# Altium project project_vodorezov_switch.PrjPcb
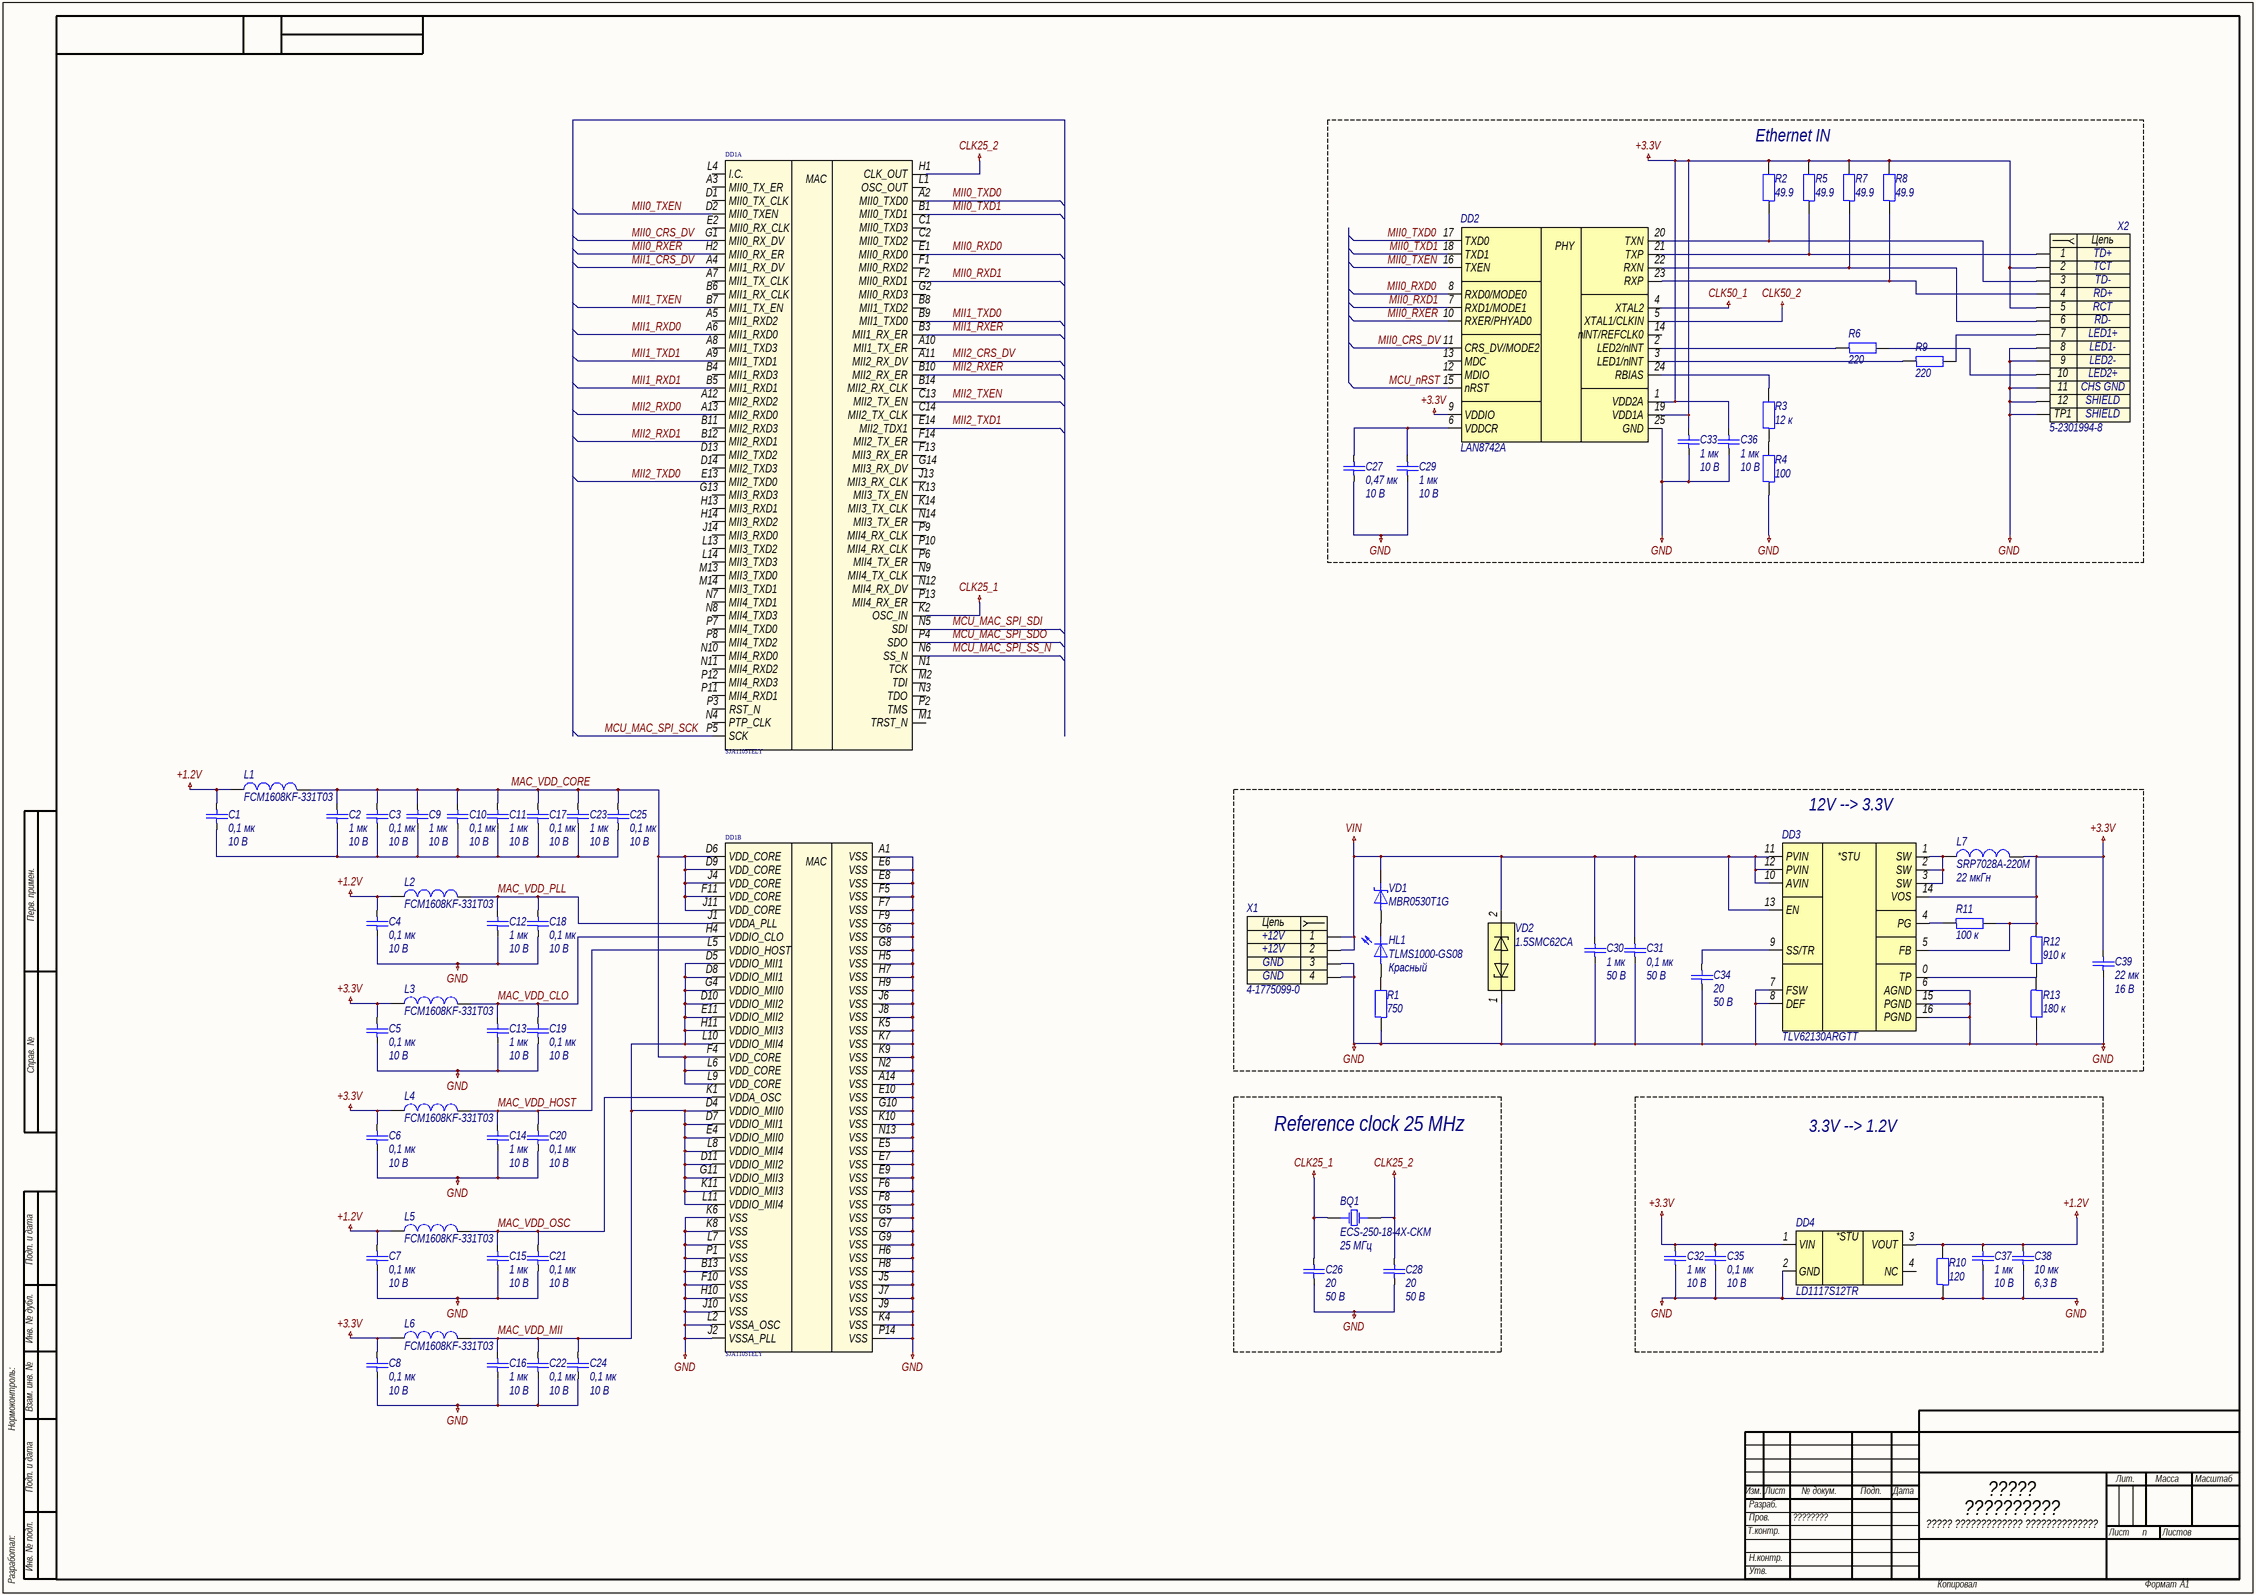
[diagram p0: project_vodorezov_switch1.SchDoc]
approver: ????????; check: ????????; designation: ?????.3331506.02; developer: ?????????; document_code: ?3; document_type: ????? ????????????? ??????????????; pcb_dec_number: ?????.3331506.02; project: project_vodorezpv_switch; sheets_total: M; title: ????? ??????????; title_line_1: ?????; title_line_2: ??????????
3 sheets, 130 parts. Net scope: global (net labels, ports and power ports of the same name join across sheets).
Board file: project_vodorezov_switch.PcbDoc
Sheets:
  project_vodorezov_switch1.SchDoc
  project_vodorezov_switch2.SchDoc
  project_vodorezov_switch3.SchDoc

## Sheet project_vodorezov_switch1.SchDoc: ????? ??????????
size 840 x 594 mm; ApprovedBy: ????????; CheckedBy: ????????; DrawnBy: ?????????; DocumentNumber: ?????.3331506.02?3; SheetNumber: n; SheetTotal: M; DocumentCode: ?3; ImagePath: ?????.3331506.02

### Parts
BQ1  ECS-250-18-4X-СKM  Частотa: 25 МГц  [HC-49/US]
C1  0,1 мк  Напряжение: 10 В  [C0603]
C2  1 мк  Напряжение: 10 В  [C0603]
C3  0,1 мк  Напряжение: 10 В  [C0603]
C4  0,1 мк  Напряжение: 10 В  [C0603]
C5  0,1 мк  Напряжение: 10 В  [C0603]
C6  0,1 мк  Напряжение: 10 В  [C0603]
C7  0,1 мк  Напряжение: 10 В  [C0603]
C8  0,1 мк  Напряжение: 10 В  [C0603]
C9  1 мк  Напряжение: 10 В  [C0603]
C10  0,1 мк  Напряжение: 10 В  [C0603]
C11  1 мк  Напряжение: 10 В  [C0603]
C12  1 мк  Напряжение: 10 В  [C0603]
C13  1 мк  Напряжение: 10 В  [C0603]
C14  1 мк  Напряжение: 10 В  [C0603]
C15  1 мк  Напряжение: 10 В  [C0603]
C16  1 мк  Напряжение: 10 В  [C0603]
C17  0,1 мк  Напряжение: 10 В  [C0603]
C18  0,1 мк  Напряжение: 10 В  [C0603]
C19  0,1 мк  Напряжение: 10 В  [C0603]
C20  0,1 мк  Напряжение: 10 В  [C0603]
C21  0,1 мк  Напряжение: 10 В  [C0603]
C22  0,1 мк  Напряжение: 10 В  [C0603]
C23  1 мк  Напряжение: 10 В  [C0603]
C24  0,1 мк  Напряжение: 10 В  [C0603]
C25  0,1 мк  Напряжение: 10 В  [C0603]
C26  20  Напряжение: 50 В  [C0402]
C27  0,47 мк  Напряжение: 10 В  [C0603]
C28  20  Напряжение: 50 В  [C0402]
C29  1 мк  Напряжение: 10 В  [C0603]
C30  1 мк  Напряжение: 50 В  [C0603]
C31  0,1 мк  Напряжение: 50 В  [C0603]
C32  1 мк  Напряжение: 10 В  [C0603]
C33  1 мк  Напряжение: 10 В  [C0603]
C34  20  Напряжение: 50 В  [C0603]
C35  0,1 мк  Напряжение: 10 В  [C0603]
C36  1 мк  Напряжение: 10 В  [C0603]
C37  1 мк  Напряжение: 10 В  [C0603]
C38  10 мк  Напряжение: 6,3 В  [C0603]
C39  22 мк  Напряжение: 16 В  [C1206]
DD1  SJA1105TELY  [BGA159]  (parts A,B of 2)
DD2  LAN8742A  [QFN-24-P50-400X400X80-L40X25-T270X270]
DD3  TLV62130ARGTT  [WQFN-16-P50-300X300X100-L40X24-T168X168]
DD4  LD1117S12TR  [SOT230P700X180-4N]
HL1  TLMS1000-GS08  Цвет: Красный  [HL0603]
L1  FCM1608KF-331T03  [FCM-2-0603]
L2  FCM1608KF-331T03  [FCM-2-0603]
L3  FCM1608KF-331T03  [FCM-2-0603]
L4  FCM1608KF-331T03  [FCM-2-0603]
L5  FCM1608KF-331T03  [FCM-2-0603]
L6  FCM1608KF-331T03  [FCM-2-0603]
L7  SRP7028A-220M  Индуктивность: 22 мкГн  [SRP-2-730X660X280]
R1  750  [R0603]
R2  49.9  [R0603]
R3  12 к  [R0603]
R4  100  [R0603]
R5  49.9  [R0603]
R6  220  [R0603]
R7  49.9  [R0603]
R8  49.9  [R0603]
R9  220  [R0603]
R10  120  [R0603]
R11  100 к  [R0603]
R12  910 к  [R0603]
R13  180 к  [R0603]
VD1  MBR0530T1G  [SOD-123-368X160X135]
VD2  1.5SMC62CA  [DO-214AB-790X590X262]
X1  4-1775099-0  [4-1775099-0]
X2  5-2301994-8  [5-2301994-8]

### Blocks framed on the sheet
Ethernet IN: C27 C29 C33 C36 DD2 R2-R9 X2
12V --> 3.3V: C30 C31 C34 C39 DD3 HL1 L7 R1 R11-R13 VD1 VD2 X1
Reference clock 25 MHz: BQ1 C26 C28
3.3V --> 1.2V: C32 C35 C37 C38 DD4 R10

### Nets
+1.2V: C1.1 C4.1 C7.1 C37.1 C38.1 DD4.3(VOUT) L1.1 L2.1 L5.1 R10.2
+3.3V: C5.1 C6.1 C8.1 C32.1 C33.1 C35.1 C36.1 C39.1 DD2.1(VDD2A) DD2.5(XTAL1/CLKIN) DD2.9(VDDIO) DD2.19(VDD1A) DD3.5(FB) DD3.14(VOS) DD4.1(VIN) L3.1 L4.1 L6.1 L7.2 R2.2 R5.2 R7.2 R8.2 R11.2 R12.1 X2.2 X2.5  [also labelled CLK50_2]
CLK25_1: C26.1 DD1.K2(OSC_IN)
CLK25_2: BQ1.2 C28.1 DD1.H1(CLK_OUT)
CLK50_1: DD2.4(XTAL2)
GND: C4.2 C5.2 C6.2 C7.2 C8.2 C12.2 C13.2 C14.2 C15.2 C16.2 C18.2 C19.2 C20.2 C21.2 C22.2 C24.2 C26.2 C27.2 C28.2 C29.2 C30.2 C31.2 C32.2 C33.2 C34.2 C35.2 C36.2 C37.2 C38.2 C39.2 DD1.A1(VSS) DD1.A14(VSS) DD1.B13(VSS) DD1.E5(VSS) DD1.E6(VSS) DD1.E7(VSS) DD1.E8(VSS) DD1.E9(VSS) DD1.E10(VSS) DD1.F5(VSS) DD1.F6(VSS) DD1.F7(VSS) DD1.F8(VSS) DD1.F9(VSS) DD1.F10(VSS) DD1.G5(VSS) DD1.G6(VSS) DD1.G7(VSS) DD1.G8(VSS) DD1.G9(VSS) DD1.G10(VSS) DD1.H5(VSS) DD1.H6(VSS) DD1.H7(VSS) DD1.H8(VSS) DD1.H9(VSS) DD1.H10(VSS) DD1.J2(VSSA_PLL) DD1.J5(VSS) DD1.J6(VSS) DD1.J7(VSS) DD1.J8(VSS) DD1.J9(VSS) DD1.J10(VSS) DD1.K4(VSS) DD1.K5(VSS) DD1.K6(VSS) DD1.K7(VSS) DD1.K8(VSS) DD1.K9(VSS) DD1.K10(VSS) DD1.L2(VSSA_OSC) DD1.L7(VSS) DD1.N2(VSS) DD1.N13(VSS) DD1.P1(VSS) DD1.P14(VSS) DD2.25(GND) DD3.6(AGND) DD3.7(FSW) DD3.8(DEF) DD3.15(PGND) DD3.16(PGND) DD4.2(GND) R1.1 R4.1 R10.1 R13.2 VD2.1 X1.3 X1.4 X2.8 X2.9 X2.11 X2.12 X2.TP1
VIN: C30.1 C31.1 DD3.10(AVIN) DD3.11(PVIN) DD3.12(PVIN) DD3.13(EN) VD1.1 VD2.2 X1.1 X1.2
MAC_VDD_CLO: C13.1 C19.1 DD1.H4(VDDIO_CLO) L3.2
MAC_VDD_CORE: C2.1 C3.1 C9.1 C10.1 C11.1 C17.1 C23.1 C25.1 DD1.D6(VDD_CORE) DD1.D9(VDD_CORE) DD1.F4(VDD_CORE) DD1.F11(VDD_CORE) DD1.J4(VDD_CORE) DD1.J11(VDD_CORE) DD1.L6(VDD_CORE) DD1.L9(VDD_CORE) L1.2
MAC_VDD_HOST: C14.1 C20.1 DD1.L5(VDDIO_HOST) L4.2
MAC_VDD_MII: C16.1 C22.1 C24.1 DD1.D4(VDDIO_MII0) DD1.D5(VDDIO_MII1) DD1.D7(VDDIO_MII1) DD1.D8(VDDIO_MII1) DD1.D10(VDDIO_MII2) DD1.D11(VDDIO_MII2) DD1.E4(VDDIO_MII0) DD1.E11(VDDIO_MII2) DD1.G4(VDDIO_MII0) DD1.G11(VDDIO_MII3) DD1.H11(VDDIO_MII3) DD1.K11(VDDIO_MII3) DD1.L8(VDDIO_MII4) DD1.L10(VDDIO_MII4) DD1.L11(VDDIO_MII4) L6.2
MAC_VDD_OSC: C15.1 C21.1 DD1.K1(VDDA_OSC) L5.2
MAC_VDD_PLL: C12.1 C18.1 DD1.J1(VDDA_PLL) L2.2
MCU_MAC_SPI_SCK: DD1.P5(SCK)
MCU_MAC_SPI_SDI: DD1.N5(SDI)
MCU_MAC_SPI_SDO: DD1.P4(SDO)
MCU_MAC_SPI_SS_N: DD1.N6(SS_N)
MCU_nRST: DD2.15(nRST)
MII0_CRS_DV: DD1.G1(MII0_RX_DV) DD2.11(CRS_DV/MODE2)
MII0_RXD0: DD1.E1(MII0_RXD0) DD2.8(RXD0/MODE0)
MII0_RXD1: DD1.F2(MII0_RXD1) DD2.7(RXD1/MODE1)
MII0_RXER: DD1.H2(MII0_RX_ER) DD2.10(RXER/PHYAD0)
MII0_TXD0: DD1.A2(MII0_TXD0) DD2.17(TXD0)
MII0_TXD1: DD1.B1(MII0_TXD1) DD2.18(TXD1)
MII0_TXEN: DD1.D2(MII0_TXEN) DD2.16(TXEN)
MII1_CRS_DV: DD1.A4(MII1_RX_DV)
MII1_RXD0: DD1.A6(MII1_RXD0)
MII1_RXD1: DD1.B5(MII1_RXD1)
MII1_RXER: DD1.B3(MII1_RX_ER)
MII1_TXD0: DD1.B9(MII1_TXD0)
MII1_TXD1: DD1.A9(MII1_TXD1)
MII1_TXEN: DD1.B7(MII1_TX_EN)
MII2_CRS_DV: DD1.A11(MII2_RX_DV)
MII2_RXD0: DD1.A13(MII2_RXD0)
MII2_RXD1: DD1.B12(MII2_RXD1)
MII2_RXER: DD1.B10(MII2_RX_ER)
MII2_TXD0: DD1.E13(MII2_TXD0)
MII2_TXD1: DD1.E14(MII2_TDX1)
MII2_TXEN: DD1.C13(MII2_TX_EN)
NetC1_2: C1.2 C2.2 C3.2 C9.2 C10.2 C11.2 C17.2 C23.2 C25.2
NetC27_1: C27.1 C29.1 DD2.6(VDDCR)
NetC34_1: C34.1 DD3.9(SS/TR)
NetDD2_2: DD2.2(LED2/nlNT) R6.1
NetDD2_3: DD2.3(LED1/nlNT) R9.1
NetDD2_20: DD2.20(TXN) R2.1 X2.3
NetDD2_21: DD2.21(TXP) R5.1 X2.1
NetDD2_22: DD2.22(RXN) R7.1 X2.6
NetDD2_23: DD2.23(RXP) R8.1 X2.4
NetDD2_24: DD2.24(RBIAS) R3.2
NetDD3_0: DD3.0(TP) R12.2 R13.1
NetDD3_1: DD3.1(SW) DD3.2(SW) DD3.3(SW) L7.1
NetDD3_4: DD3.4(PG) R11.1
NetHL1_1: HL1.1 VD1.2
NetHL1_2: HL1.2 R1.2
NetR3_1: R3.1 R4.2
NetR6_2: R6.2 X2.10
NetR9_2: R9.2 X2.7

Not connected (* = marked no-connect by the designer): BQ1 1; DD1 A3(MII0_TX_ER) A5(MII1_RXD2) A7(MII1_TX_CLK) A8(MII1_TXD3) A10(MII1_TX_ER) A12(MII2_RXD2) B4(MII1_RXD3) B6(MII1_RX_CLK) B8(MII1_TXD2) B11(MII2_RXD3) B14(MII2_RX_CLK) C1(MII0_TXD3) C2(MII0_TXD2) C14(MII2_TX_CLK) D1(MII0_TX_CLK) D13(MII2_TXD2) D14(MII2_TXD3) E2(MII0_RX_CLK) F1(MII0_RXD2) F13(MII3_RX_ER) F14(MII2_TX_ER) G2(MII0_RXD3) G13(MII3_RXD3) G14(MII3_RX_DV) H13(MII3_RXD1) H14(MII3_RXD2) J13(MII3_RX_CLK) J14(MII3_RXD0) K13(MII3_TX_EN) K14(MII3_TX_CLK) L1(OSC_OUT) L4(I.C.) L13(MII3_TXD2) L14(MII3_TXD3) M1(TRST_N) M2(TDI) M13(MII3_TXD0) M14(MII3_TXD1) N1(TCK) N3(TDO) N4(PTP_CLK) N7(MII4_TXD1) N8(MII4_TXD3) N9(MII4_TX_CLK) N10(MII4_RXD0) N11(MII4_RXD2) N12(MII4_RX_DV) N14(MII3_TX_ER) P2(TMS) P3(RST_N) P6(MII4_TX_ER) P7(MII4_TXD0) P8(MII4_TXD2) P9(MII4_RX_CLK) P10(MII4_RX_CLK) P11(MII4_RXD1) P12(MII4_RXD3) P13(MII4_RX_ER); DD2 12(MDIO) 13(MDC) 14(nlNT/REFCLK0); DD4 4(NC)

### Notes on the sheet
- Перв. примен.
- Справ. №
- Подп. и дата
- Инв. № дубл.
- Нормоконтроль:
- Взам. инв. №
- Изм.
- Лист
- № докум.
- Подп.
- Дата
- Лит.
- Масса
- Масштаб
- Т.контр.
- Пров.
- Разраб.
- Листов
- Разработал:
- Инв. № подл.
- Н.контр.
- Утв.
- Копировал
- Формат
- А1
- (in symbol dd0017) *STU
- (in symbol dd0025) *STU
- (in symbol dd0028) PHY
- (in symbol dd0029, part A) MAC
- (in symbol dd0029, part B) MAC
- (in symbol x0006) Цепь
- (in symbol x0015) Цепь

### Library data of the parts
BQ1 = bq0008: =Описание; ID: bq0008; Фамилия: Водорезов; Описание: Кварцевый резонатор 25 МГц нагрузочные конденсаторы 18 пФ; Производитель: ECS, Inc. International; Наименование: ECS-250-18-4X-СKM; Частота: 25 МГц; Корпус: HC-49/US; HelpURL: https://ecsxtal.com/hc-49usx
C1 C3-C8 C10 C17-C22 C24 C25 C35 = c0081: =Описание; ID: c0081; Фамилия: Паньков; Описание: Конденсатор керамический чип 0603 100 нФ 10 В ±10 %; Наименование: CC0603KRX7R6BB104; Производитель: YAGEO Corp.; Отклонение: ±10 %; Рабочие температуры: от –55 °С до +125 °С; Температурный коэффициент емкости: X7R; Корпус: 0603; Номинал: 0,1 мк; Номинальное напряжение: 10 В; HelpURL: https://www.yageo.com/upload/media/product/productsearch/datasheet/mlcc/UPY-GPHC_X7R_6.3V-to-50V_20.pdf
C2 C9 C11-C16 C23 C29 C32 C33 C36 C37 = c0112: =Описание; ID: c0112; Фамилия: Паньков; Описание: Конденсатор керамический чип 0603 1 мкФ 10 В ±10 %; Наименование: CC0603KRX5R6BB105; Производитель: YAGEO Corp.; Отклонение: ±10 %; Рабочие температуры: от –55 °С до +85 °С; Температурный коэффициент емкости: X5R; Корпус: 0603; Номинал: 1 мк; Номинальное напряжение: 10 В; HelpURL: https://www.yageo.com/upload/media/product/productsearch/datasheet/mlcc/UPY-GPHC_X5R_4V-to-50V_26.pdf
C26 C28 = c0020: =Описание; ID: c0020; Фамилия: Ляпцев; Описание: Конденсатор керамический чип 0402 20 пФ 50 В ±5 %; Наименование: CC0402JRNPO9BN200; Производитель: YAGEO Corp.; Отклонение: ±5 %; Рабочие температуры: от –55 °С до +125 °С; Температурный коэффициент емкости: C0G; Корпус: 0402; Номинал: 20; Номинальное напряжение: 50 В; HelpURL: https://www.yageo.com/upload/media/product/productsearch/datasheet/mlcc/UPY-GP_NP0_16V-to-50V_18.pdf
C27 = c0103: =Описание; ID: c0103; Фамилия: Паньков; Описание: Конденсатор керамический чип 0603 470 нФ 10 В ±10 %; Наименование: CC0603KRX7R6BB474; Производитель: YAGEO Corp.; Отклонение: ±10 %; Рабочие температуры: от –55 °С до +125 °С; Температурный коэффициент емкости: X7R; Корпус: 0603; Номинал: 0,47 мк; Номинальное напряжение: 10 В; HelpURL: https://www.yageo.com/upload/media/product/productsearch/datasheet/mlcc/UPY-GPHC_X7R_6.3V-to-50V_20.pdf
C30 = c0118: =Описание; ID: c0118; Фамилия: Самарин; Описание: Конденсатор керамический чип 0603 1 мкФ 50 В ±10 %; Наименование: CC0603KPX5R9BB105; Производитель: YAGEO Corp.; Отклонение: ±10 %; Рабочие температуры: от –55 °С до +85 °С; Температурный коэффициент емкости: X5R; Корпус: 0603; Номинал: 1 мк; Номинальное напряжение: 50 В; HelpURL: https://www.yageo.com/upload/media/product/productsearch/datasheet/mlcc/UPY-GPHC_X5R_4V-to-50V_26.pdf
C31 = c0088: =Описание; ID: c0088; Фамилия: Паньков; Описание: Конденсатор керамический чип 0603 100 нФ 50 В ±10 %; Наименование: CC0603KRX7R9BB104; Производитель: YAGEO Corp.; Отклонение: ±10 %; Рабочие температуры: от –55 °С до +125 °С; Температурный коэффициент емкости: X7R; Корпус: 0603; Номинал: 0,1 мк; Номинальное напряжение: 50 В; HelpURL: https://www.yageo.com/upload/media/product/productsearch/datasheet/mlcc/UPY-GPHC_X7R_6.3V-to-50V_20.pdf
C34 = c0021: =Описание; ID: c0021; Фамилия: Паньков; Описание: Конденсатор керамический чип 0603 20 пФ 50 В ±1 %; Наименование: CC0603FRNPO9BN200; Производитель: YAGEO Corp.; Отклонение: ±1 %; Рабочие температуры: от –55 °С до +125 °С; Температурный коэффициент емкости: C0G; Корпус: 0603; Номинал: 20; Номинальное напряжение: 50 В; HelpURL: https://www.yageo.com/upload/media/product/productsearch/datasheet/mlcc/UPY-GP_NP0_16V-to-50V_18.pdf
C38 = c0143: =Описание; ID: c0143; Фамилия: Ляпцев; Описание: Конденсатор керамический чип 0603 10 мкФ 6,3 В ±20 %; Наименование: CC0603MRX5R5BB106; Производитель: YAGEO Corp.; Отклонение: ±20 %; Рабочие температуры: от –55 °С до +85 °С; Температурный коэффициент емкости: X5R; Корпус: 0603; Номинал: 10 мк; Номинальное напряжение: 6,3 В; HelpURL: https://www.yageo.com/upload/media/product/productsearch/datasheet/mlcc/UPY-GPHC_X5R_4V-to-50V_26.pdf
C39 = c0163: =Описание; ID: c0163; Фамилия: Ларионов; Описание: Конденсатор керамический чип 1206 22 мкФ 16 В ±20 %; Наименование: CC1206MKX7R7BB226; Производитель: YAGEO Corp.; Отклонение: ±20 %; Рабочие температуры: от –55 °С до +125 °С; Температурный коэффициент емкости: X7R; Корпус: 1206; Номинал: 22 мк; Номинальное напряжение: 16 В; HelpURL: https://www.yageo.com/upload/media/product/productsearch/datasheet/mlcc/UPY-GPHC_X7R_6.3V-to-50V_20.pdf
DD1 = dd0029: =Описание; SourceLibrary: Add_to_database_2020-10-19; Vendor: NXP; Built_By: EMA_Matt; ID: dd0029; Фамилия: Водорезов; Описание: Ethernet-switch на 5 выхода; Корпус: LFBGA-159; Datasheet: https://www.nxp.com/docs/en/data-sheet/SJA1105.pdf; Manufacturer_Part_Number: SJA1105TELY; Copyright: Copyright (C) 2018 Accelerated Designs. All rights reserved; RefDes: RefDes; Type: DEV; Наименование: SJA1105; Производитель: NXP; HelpURL: https://www.nxp.com/docs/en/data-sheet/SJA1105.pdf
DD2 = dd0028: =Описание; ID: dd0028; Фамилия: Водорезов; Описание: Ethernet-transiver PHY; Производитель: Microchip; Корпус: QFN-24; Наименование: LAN8742A; HelpURL: http://ww1.microchip.com/downloads/en/DeviceDoc/8742a.pdf
DD3 = dd0017: =Описание; ID: dd0017; Фамилия: Самарин; Описание: Понижающий преобразователь напряжения 3,0…17 В / 0,9…5,25 В и 3,0 А; Производитель: Texas Instruments Inc.; Входное напряжение: от 3,0 В до 17 В; Выходное напряжение: от 0,9 до 5,25 В; Коммутируемый ток: до 3,0 А; Частота переключения: от 1,25 МГц до 2,5 МГц; Рабочие температуры: от –40 °С до +85 °С; Корпус: WQFN-16; Наименование: TLV62130ARGTT; HelpURL: https://www.ti.com/product/TLV62130
DD4 = dd0025: =Описание; ID: dd0025; Фамилия: Водорезов; Описание: Линейный понижающий преобразователь напряжения 1.3-15 В / 1.2 В и 0.8 А; Производитель: STMicroelectronics; Входное напряжение: до 15 В; Выходное напряжение: 1.2 В; Коммутируемый ток: до 0.8 А; Рабочие температуры: от –40 °С до +125 °С; Корпус: SOT-223; Наименование: LD1117S12TR; Частота переключения: -; HelpURL: http://www.farnell.com/datasheets/1776449.pdf
HL1 = hl0001: =Описание; ID: hl0001; Фамилия: Ларионов; Описание: Светодиод чип 0603 красный; Производитель: Vishay Intertechnology, Inc.; Номинальная сила света: 4 мкд; Номинальная длина волны: 628 нм; Номинальный прямой ток: 15 мА; Номинальное падение напряжения: 1,8 В; Рассеиваемая мощность: 40 мВт; Рабочие температуры: от –40 °С до +100 °С; Корпус: 0603; Наименование: TLMS1000-GS08; HelpURL: https://www.vishay.com/leds/list/product-83172/
L1-L6 = l0005: =Описание; ID: l0005; Фамилия: Водорезов; Описание: Ферритовая бусина 330 Ом ±25 %; Производитель: TAI-TECH Advanced Electronics Co., Ltd.; Сопротивление, 100 МГц: 330 Ом; Отклонение, 100 МГц: ±25 %; Сопротивление при постоянном токе: 0,5 Ом; Рабочие температуры: от –55 °С до +125 °С; Корпус: 0603; Наименование: FCM1608KF-331T03; HelpURL: https://www.tai-tech.com.tw/en/product?mcls=&cls=1489980553&cls2=1490267380&cls3=&pid=1491959545
L7 = l0013: =Описание; ID: l0013; Фамилия: Ларионов; Описание: Катушка индуктивности 22 мкГн ±20 %; Производитель: Bourns, Inc.; Отклонение: ±20 %; Номинальное активное сопротивление: 165 мОм; Максимальное активное сопротивление: 190 мОм; Резонансная частота: 10 МГц; Номинальный ток (при нагреве на 20 °С/40 °С): 2 А; Ток насыщения: 3,5 А; Рабочее напряжение: не указано; Рабочие температуры: от –55 °С до +150 °С; Корпус: 7,3 x 6,6 x 2,8; Наименование: SRP7028A-220M; Номинал: 22 мкГн; HelpURL: https://www.bourns.com/products/magnetic-products/power-inductors-aec-q200-compliant/product/SRP7028A
R1 = r0028: =Описание; ID: r0028; Фамилия: Паньков; Описание: Резистор чип 0603 750 Ом ±1 % 0,1 Вт; Наименование: RC0603FR-07750RL; Производитель: YAGEO Corp.; Отклонение: ±1 %; Номинальное напряжение: 75 В; Номинальный ток: 1 А; Рабочие температуры: от –55 °С до +155 °С; Корпус: 0603; Примечание: Ряд E24; Номинал: 750; HelpURL: https://www.yageo.com/upload/media/product/productsearch/datasheet/rchip/PYu-RC_Group_51_RoHS_L_11.pdf
R2 R5 R7 R8 = r0204: =Описание; ID: r0204; Фамилия: Водорезов; Описание: Резистор чип 0603 49 Ом ±1 % 0,1 Вт; Наименование: RC0603FR-0749RL; Производитель: YAGEO Corp.; Отклонение: ±1 %; Номинальное напряжение: 75 В; Номинальный ток: 1 А; Рабочие температуры: от –55 °С до +155 °С; Корпус: 0603; Примечание: Ряд E24; Номинал: 49.9; HelpURL: https://www.yageo.com/upload/media/product/productsearch/datasheet/rchip/PYu-RC_Group_51_RoHS_L_11.pdf
R3 = r0108: =Описание; ID: r0108; Фамилия: Паньков; Описание: Резистор чип 0603 12 кОм ±1 % 0,1 Вт; Наименование: RC0603FR-0712KL; Производитель: YAGEO Corp.; Отклонение: ±1 %; Номинальное напряжение: 75 В; Номинальный ток: 1 А; Рабочие температуры: от –55 °С до +155 °С; Корпус: 0603; Примечание: Ряд E24; Номинал: 12 к; HelpURL: https://www.yageo.com/upload/media/product/productsearch/datasheet/rchip/PYu-RC_Group_51_RoHS_L_11.pdf
R4 = r0052: =Описание; ID: r0052; Фамилия: Самарин; Описание: Резистор чип 0603 100 Ом ±1 % 0,1 Вт; Наименование: RC0603FR‍‐07100RL; Производитель: YAGEO Corp.; Отклонение: ±1 %; Номинальное напряжение: 75 В; Номинальный ток: 1 А; Рабочие температуры: от –55 °С до +155 °С; Корпус: 0603; Примечание: Ряд E24; Номинал: 100; HelpURL: https://www.yageo.com/upload/media/product/productsearch/datasheet/rchip/PYu-RC_Group_51_RoHS_L_11.pdf
R6 R9 = r0060: =Описание; ID: r0060; Фамилия: Ларионов; Описание: Резистор чип 0603 220 Ом ±1 % 0,1 Вт; Наименование: RC0603FR-07220RL; Производитель: YAGEO Corp.; Отклонение: ±1 %; Номинальное напряжение: 75 В; Номинальный ток: 1 А; Рабочие температуры: от –55 °С до +155 °С; Корпус: 0603; Примечание: Ряд E24; Номинал: 220; HelpURL: https://www.yageo.com/upload/media/product/productsearch/datasheet/rchip/PYu-RC_Group_51_RoHS_L_11.pdf
R10 = r0054: =Описание; ID: r0054; Фамилия: Самарин; Описание: Резистор чип 0603 120 Ом ±1 % 0,1 Вт; Наименование: RC0603FR‍‐07120RL; Производитель: YAGEO Corp.; Отклонение: ±1 %; Номинальное напряжение: 75 В; Номинальный ток: 1 А; Рабочие температуры: от –55 °С до +155 °С; Корпус: 0603; Примечание: Ряд E24; Номинал: 120; HelpURL: https://www.yageo.com/upload/media/product/productsearch/datasheet/rchip/PYu-RC_Group_51_RoHS_L_11.pdf
R11 = r0141: =Описание; ID: r0141; Фамилия: Водорезов; Описание: Резистор чип 0603 100 кОм ±1 % 0,1 Вт; Наименование: RC0603FR-07100KL; Производитель: YAGEO Corp.; Отклонение: ±1 %; Номинальное напряжение: 75 В; Номинальный ток: 1 А; Рабочие температуры: от –55 °С до +155 °С; Корпус: 0603; Примечание: Ряд E24; Номинал: 100 к; HelpURL: https://www.yageo.com/upload/media/product/productsearch/datasheet/rchip/PYu-RC_Group_51_RoHS_L_11.pdf
R12 = r0172: =Описание; ID: r0172; Фамилия: Паньков; Описание: Резистор чип 0603 910 кОм ±1 % 0,1 Вт; Наименование: RC0603FR-07910KL; Производитель: YAGEO Corp.; Отклонение: ±1 %; Номинальное напряжение: 75 В; Номинальный ток: 1 А; Рабочие температуры: от –55 °С до +155 °С; Корпус: 0603; Примечание: Ряд E24; Номинал: 910 к; HelpURL: https://www.yageo.com/upload/media/product/productsearch/datasheet/rchip/PYu-RC_Group_51_RoHS_L_11.pdf
R13 = r0152: =Описание; ID: r0152; Фамилия: Паньков; Описание: Резистор чип 0603 180 кОм ±1 % 0,1 Вт; Наименование: RC0603FR-07180KL; Производитель: YAGEO Corp.; Отклонение: ±1 %; Номинальное напряжение: 75 В; Номинальный ток: 1 А; Рабочие температуры: от –55 °С до +155 °С; Корпус: 0603; Примечание: Ряд E24; Номинал: 180 к; HelpURL: https://www.yageo.com/upload/media/product/productsearch/datasheet/rchip/PYu-RC_Group_51_RoHS_L_11.pdf
VD1 = vd0001: =Описание; ID: vd0001; Фамилия: Шкабара; Описание: Диод Шоттки 30 В 0,5 А; Производитель: ON Semiconductor; Максимальное прямое напряжение: 0,43 В; Максимальное обратное напряжение: 30 В; Максимальный прямой ток: 0,5 А; Рабочие температуры: от –65 °С до +125 °С; Корпус: SOD-123; Наименование: MBR0530T1G; HelpURL: https://www.onsemi.com/products/discretes-drivers/diodes-rectifiers/schottky-diodes-schottky-rectifiers/mbr0530t1g
VD2 = vd0009: =Описание; ID: vd0009; Фамилия: Ларионов; Описание: Двунаправленная диодная сборка для подавления помех 53 В; Производитель: Littelfuse, Inc.; Корпус: DO-214AB; Наименование: 1.5SMC62CA; HelpURL: https://www.littelfuse.com/products/tvs-diodes/surface-mount/1_5smc.aspx
X1 = x0006: =Описание; Contact_1: +12V; Contact_3: GND; ID: x0006; Фамилия: Ларионов; Описание: ATX Power 4 pin гнездо прямой; Производитель: TE Connectivity; Contact_2: +12V; Contact_4: GND; Наименование: 4-1775099-0; HelpURL: https://www.te.com/usa-en/product-4-1775099-0.html
X2 = x0015: =Описание; Contact_1: TD+; Contact_2: TCT; Contact_3: TD-; Contact_4: RD+; Contact_5: RCT; Contact_6: RD-; Contact_7: LED1+; Contact_8: LED1-; Contact_9: LED2-; Contact_10: LED2+; Contact_11: CHS GND; TP1: SHIELD; ID: x0015; Фамилия: Ларионов; Описание: RJ45 интегрированный трансформатор 10/100 Mbps LED гнездо угловой; Производитель: TE Connectivity; Contact_12: SHIELD; Наименование: 5-2301994-8; HelpURL: https://www.te.com/usa-en/product-5-2301994-8.html

## Sheet project_vodorezov_switch2.SchDoc: ????? ??????????
size 594 x 420 mm; DocumentCode: ?3
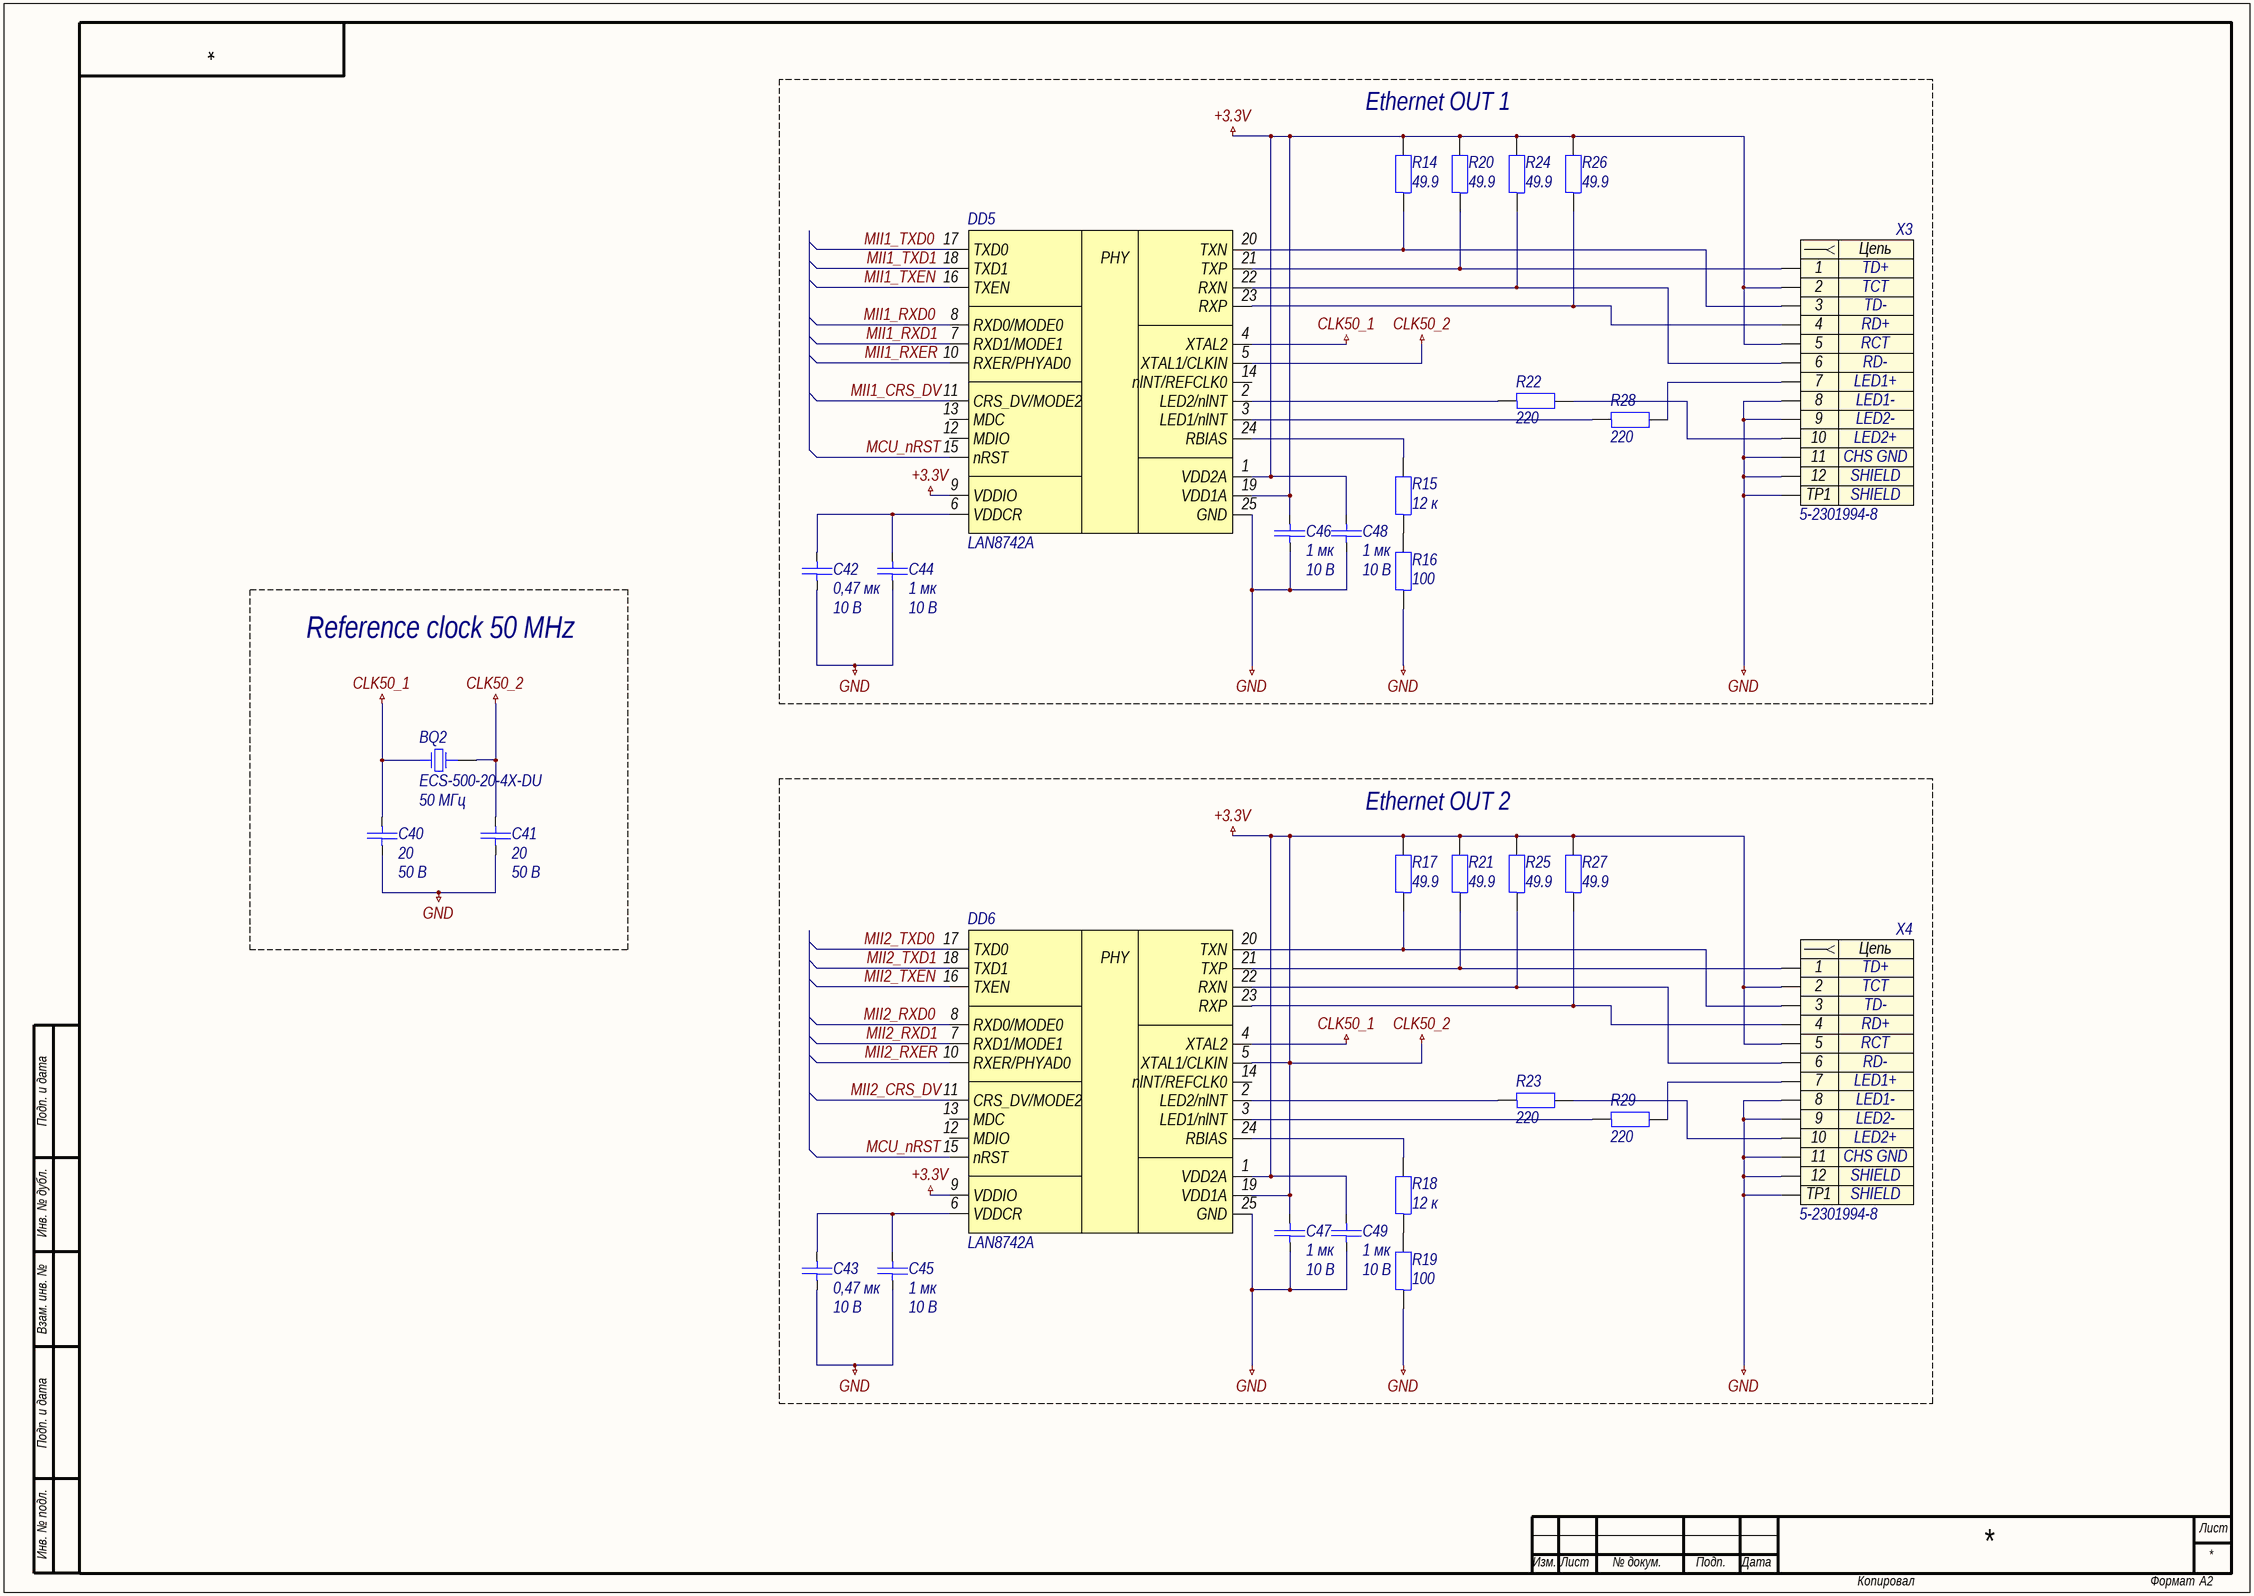
[diagram p1: project_vodorezov_switch2.SchDoc]

### Parts
BQ2  ECS-500-20-4X-DU  Частотa: 50 МГц  [HC-49/US]
C40  20  Напряжение: 50 В  [C0402]
C41  20  Напряжение: 50 В  [C0402]
C42  0,47 мк  Напряжение: 10 В  [C0603]
C43  0,47 мк  Напряжение: 10 В  [C0603]
C44  1 мк  Напряжение: 10 В  [C0603]
C45  1 мк  Напряжение: 10 В  [C0603]
C46  1 мк  Напряжение: 10 В  [C0603]
C47  1 мк  Напряжение: 10 В  [C0603]
C48  1 мк  Напряжение: 10 В  [C0603]
C49  1 мк  Напряжение: 10 В  [C0603]
DD5  LAN8742A  [QFN-24-P50-400X400X80-L40X25-T270X270]
DD6  LAN8742A  [QFN-24-P50-400X400X80-L40X25-T270X270]
R14  49.9  [R0603]
R15  12 к  [R0603]
R16  100  [R0603]
R17  49.9  [R0603]
R18  12 к  [R0603]
R19  100  [R0603]
R20  49.9  [R0603]
R21  49.9  [R0603]
R22  220  [R0603]
R23  220  [R0603]
R24  49.9  [R0603]
R25  49.9  [R0603]
R26  49.9  [R0603]
R27  49.9  [R0603]
R28  220  [R0603]
R29  220  [R0603]
X3  5-2301994-8  [5-2301994-8]
X4  5-2301994-8  [5-2301994-8]

### Blocks framed on the sheet
Ethernet OUT 1: C42 C44 C46 C48 DD5 R14-R16 R20 R22 R24 R26 R28 X3
Reference clock 50 MHz: BQ2 C40 C41
Ethernet OUT 2: C43 C45 C47 C49 DD6 R17-R19 R21 R23 R25 R27 R29 X4

### Nets
+3.3V: BQ2.2 C41.1 C46.1 C47.1 C48.1 C49.1 DD5.1(VDD2A) DD5.5(XTAL1/CLKIN) DD5.9(VDDIO) DD5.19(VDD1A) DD6.1(VDD2A) DD6.5(XTAL1/CLKIN) DD6.9(VDDIO) DD6.19(VDD1A) R14.2 R17.2 R20.2 R21.2 R24.2 R25.2 R26.2 R27.2 X3.2 X3.5 X4.2 X4.5  [also labelled CLK50_2]
CLK50_1: BQ2.1 C40.1 DD5.4(XTAL2) DD6.4(XTAL2)
GND: C40.2 C41.2 C42.2 C43.2 C44.2 C45.2 C46.2 C47.2 C48.2 C49.2 DD5.25(GND) DD6.25(GND) R16.1 R19.1 X3.8 X3.9 X3.11 X3.12 X3.TP1 X4.8 X4.9 X4.11 X4.12 X4.TP1
MCU_nRST: DD5.15(nRST) DD6.15(nRST)
MII1_CRS_DV: DD5.11(CRS_DV/MODE2)
MII1_RXD0: DD5.8(RXD0/MODE0)
MII1_RXD1: DD5.7(RXD1/MODE1)
MII1_RXER: DD5.10(RXER/PHYAD0)
MII1_TXD0: DD5.17(TXD0)
MII1_TXD1: DD5.18(TXD1)
MII1_TXEN: DD5.16(TXEN)
MII2_CRS_DV: DD6.11(CRS_DV/MODE2)
MII2_RXD0: DD6.8(RXD0/MODE0)
MII2_RXD1: DD6.7(RXD1/MODE1)
MII2_RXER: DD6.10(RXER/PHYAD0)
MII2_TXD0: DD6.17(TXD0)
MII2_TXD1: DD6.18(TXD1)
MII2_TXEN: DD6.16(TXEN)
NetC42_1: C42.1 C44.1 DD5.6(VDDCR)
NetC43_1: C43.1 C45.1 DD6.6(VDDCR)
NetDD5_2: DD5.2(LED2/nlNT) R22.1
NetDD5_3: DD5.3(LED1/nlNT) R28.1
NetDD5_20: DD5.20(TXN) R14.1 X3.3
NetDD5_21: DD5.21(TXP) R20.1 X3.1
NetDD5_22: DD5.22(RXN) R24.1 X3.6
NetDD5_23: DD5.23(RXP) R26.1 X3.4
NetDD5_24: DD5.24(RBIAS) R15.2
NetDD6_2: DD6.2(LED2/nlNT) R23.1
NetDD6_3: DD6.3(LED1/nlNT) R29.1
NetDD6_20: DD6.20(TXN) R17.1 X4.3
NetDD6_21: DD6.21(TXP) R21.1 X4.1
NetDD6_22: DD6.22(RXN) R25.1 X4.6
NetDD6_23: DD6.23(RXP) R27.1 X4.4
NetDD6_24: DD6.24(RBIAS) R18.2
NetR15_1: R15.1 R16.2
NetR18_1: R18.1 R19.2
NetR22_2: R22.2 X3.10
NetR23_2: R23.2 X4.10
NetR28_2: R28.2 X3.7
NetR29_2: R29.2 X4.7

Not connected (* = marked no-connect by the designer): DD5 12(MDIO) 13(MDC) 14(nlNT/REFCLK0); DD6 12(MDIO) 13(MDC) 14(nlNT/REFCLK0)

### Notes on the sheet
- Подп. и дата
- Инв. № дубл.
- Взам. инв. №
- Инв. № подл.
- Лист
- Изм.
- № докум.
- Подп.
- Дата
- Копировал
- Формат
- А2
- (in symbol dd0028) PHY
- (in symbol x0015) Цепь

### Library data of the parts
BQ2 = bq0007: =Описание; ID: bq0007; Фамилия: Водорезов; Описание: Кварцевый резонатор 50 МГц нагрузочные конденсаторы 20 пФ; Производитель: ECS, Inc. International; Наименование: ECS-500-20-4X-DU; Частота: 50 МГц; Корпус: HC-49/US; HelpURL: https://ecsxtal.com/hc-49usx
C40 C41 = c0020: as C26 on sheet project_vodorezov_switch1; Номинал: 20; Номинальное напряжение: 50 В; HelpURL: https://www.yageo.com/upload/media/product/productsearch/datasheet/mlcc/UPY-GP_NP0_16V-to-50V_18.pdf
C42 C43 = c0103: as C27 on sheet project_vodorezov_switch1; Номинал: 0,47 мк; Номинальное напряжение: 10 В; HelpURL: https://www.yageo.com/upload/media/product/productsearch/datasheet/mlcc/UPY-GPHC_X7R_6.3V-to-50V_20.pdf
C44-C49 = c0112: as C2 on sheet project_vodorezov_switch1; Номинал: 1 мк; Номинальное напряжение: 10 В; HelpURL: https://www.yageo.com/upload/media/product/productsearch/datasheet/mlcc/UPY-GPHC_X5R_4V-to-50V_26.pdf
DD5 DD6 = dd0028: as DD2 on sheet project_vodorezov_switch1; Наименование: LAN8742A; HelpURL: http://ww1.microchip.com/downloads/en/DeviceDoc/8742a.pdf
R14 R17 R20 R21 R24-R27 = r0204: as R2 on sheet project_vodorezov_switch1; Номинал: 49.9; HelpURL: https://www.yageo.com/upload/media/product/productsearch/datasheet/rchip/PYu-RC_Group_51_RoHS_L_11.pdf
R15 R18 = r0108: as R3 on sheet project_vodorezov_switch1; Номинал: 12 к; HelpURL: https://www.yageo.com/upload/media/product/productsearch/datasheet/rchip/PYu-RC_Group_51_RoHS_L_11.pdf
R16 R19 = r0052: as R4 on sheet project_vodorezov_switch1; Номинал: 100; HelpURL: https://www.yageo.com/upload/media/product/productsearch/datasheet/rchip/PYu-RC_Group_51_RoHS_L_11.pdf
R22 R23 R28 R29 = r0060: as R6 on sheet project_vodorezov_switch1; Номинал: 220; HelpURL: https://www.yageo.com/upload/media/product/productsearch/datasheet/rchip/PYu-RC_Group_51_RoHS_L_11.pdf
X3 X4 = x0015: as X2 on sheet project_vodorezov_switch1; Contact_12: SHIELD; Наименование: 5-2301994-8; HelpURL: https://www.te.com/usa-en/product-5-2301994-8.html

## Sheet project_vodorezov_switch3.SchDoc: ????? ??????????
size 840 x 594 mm; DocumentCode: ?3
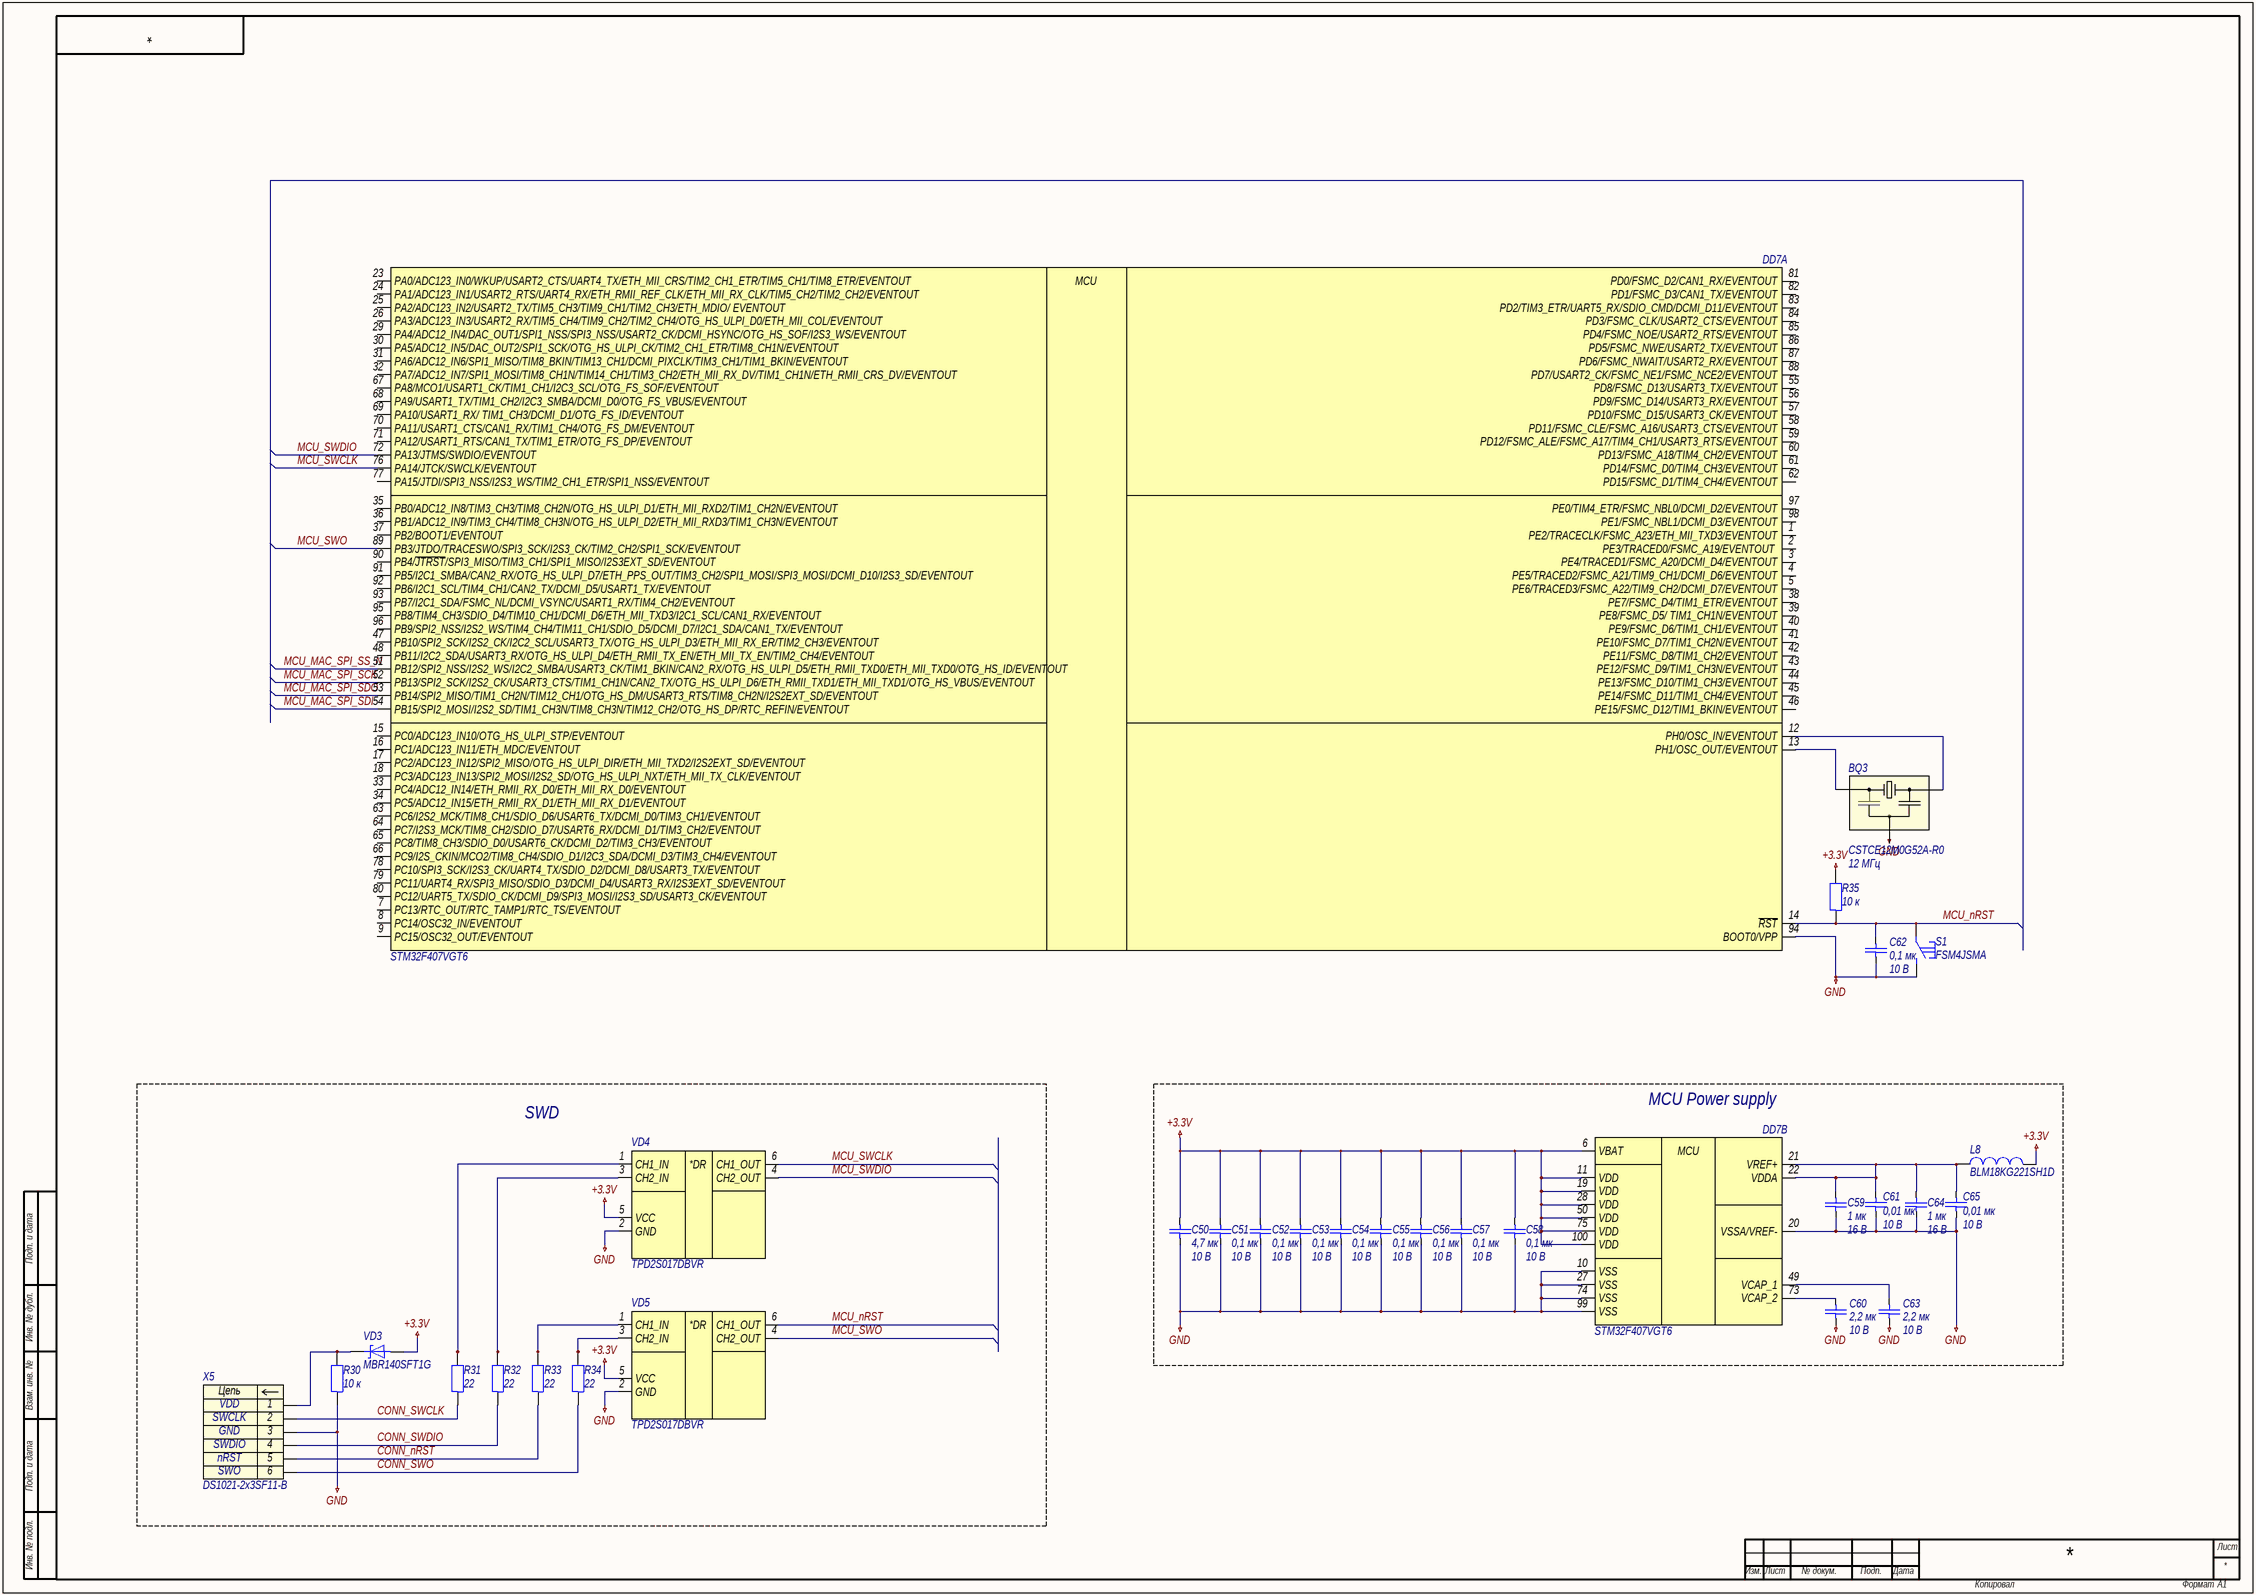
[diagram p2: project_vodorezov_switch3.SchDoc]

### Parts
BQ3  CSTCE12M0G52A-R0  Частотa: 12 МГц  [CSTCE-3-P120-320X130X70]
C50  4,7 мк  Напряжение: 10 В  [C0603]
C51  0,1 мк  Напряжение: 10 В  [C0402]
C52  0,1 мк  Напряжение: 10 В  [C0402]
C53  0,1 мк  Напряжение: 10 В  [C0402]
C54  0,1 мк  Напряжение: 10 В  [C0402]
C55  0,1 мк  Напряжение: 10 В  [C0402]
C56  0,1 мк  Напряжение: 10 В  [C0402]
C57  0,1 мк  Напряжение: 10 В  [C0402]
C58  0,1 мк  Напряжение: 10 В  [C0402]
C59  1 мк  Напряжение: 16 В  [C0603]
C60  2,2 мк  Напряжение: 10 В  [C0603]
C61  0,01 мк  Напряжение: 10 В  [C0603]
C62  0,1 мк  Напряжение: 10 В  [C0603]
C63  2,2 мк  Напряжение: 10 В  [C0603]
C64  1 мк  Напряжение: 16 В  [C0603]
C65  0,01 мк  Напряжение: 10 В  [C0603]
DD7  STM32F407VGT6  [LQFP-100-P50-1400X1400X160-L60X22]  (parts A,B of 2)
L8  BLM18KG221SH1D  [BLM-2-0603]
R30  10 к  [R0603]
R31  22  [R0603]
R32  22  [R0603]
R33  22  [R0603]
R34  22  [R0603]
R35  10 к  [R0603]
S1  FSM4JSMA  [FSM4JSMA]
VD3  MBR140SFT1G  [SOD-123FL-370X165X98]
VD4  TPD2S017DBVR  [SOT-23-6-P95-290X280X145]
VD5  TPD2S017DBVR  [SOT-23-6-P95-290X280X145]
X5  DS1021-2x3SF11-B  [DS1021-2X3SF11-B]

### Blocks framed on the sheet
SWD: R30-R34 VD3-VD5 X5
MCU Power supply: C50-C61 C63-C65 DD7 L8

### Nets
+3.3V: C50.1 C51.1 C52.1 C53.1 C54.1 C55.1 C56.1 C57.1 C58.1 DD7.6(VBAT) DD7.11(VDD) DD7.19(VDD) DD7.28(VDD) DD7.50(VDD) DD7.75(VDD) DD7.100(VDD) L8.2 R35.2 VD3.2 VD4.5(VCC) VD5.5(VCC)
GND: C50.2 C51.2 C52.2 C53.2 C54.2 C55.2 C56.2 C57.2 C58.2 C59.2 C60.2 C61.2 C62.2 C63.2 C64.2 C65.2 DD7.10(VSS) DD7.20(VSSA/VREF-) DD7.27(VSS) DD7.74(VSS) DD7.94(BOOT0/VPP) DD7.99(VSS) R30.1 S1.2 VD4.2(GND) VD5.2(GND) X5.3
CONN_nRST: R33.1 X5.5
CONN_SWCLK: R31.1 X5.2
CONN_SWDIO: R32.1 X5.4
CONN_SWO: R34.1 X5.6
MCU_MAC_SPI_SCK: DD7.52(PB13/SPI2_SCK/I2S2_CK/USART3_CTS/TIM1_CH1N/CAN2_TX/OTG_HS_ULPI_D6/ETH_RMII_TXD1/ETH_MII_TXD1/OTG_HS_VBUS/EVENTOUT)
MCU_MAC_SPI_SDI: DD7.54(PB15/SPI2_MOSI/I2S2_SD/TIM1_CH3N/TIM8_CH3N/TIM12_CH2/OTG_HS_DP/RTC_REFIN/EVENTOUT)
MCU_MAC_SPI_SDO: DD7.53(PB14/SPI2_MISO/TIM1_CH2N/TIM12_CH1/OTG_HS_DM/USART3_RTS/TIM8_CH2N/I2S2EXT_SD/EVENTOUT)
MCU_MAC_SPI_SS_N: DD7.51(PB12/SPI2_NSS/I2S2_WS/I2C2_SMBA/USART3_CK/TIM1_BKIN/CAN2_RX/OTG_HS_ULPI_D5/ETH_RMII_TXD0/ETH_MII_TXD0/OTG_HS_ID/EVENTOUT)
MCU_nRST: C62.1 DD7.14(~{RST}) R35.1 S1.1 VD5.6(CH1_OUT)
MCU_SWCLK: DD7.76(PA14/JTCK/SWCLK/EVENTOUT) VD4.6(CH1_OUT)
MCU_SWDIO: DD7.72(PA13/JTMS/SWDIO/EVENTOUT) VD4.4(CH2_OUT)
MCU_SWO: DD7.89(PB3/JTDO/TRACESWO/SPI3_SCK/I2S3_CK/TIM2_CH2/SPI1_SCK/EVENTOUT) VD5.4(CH2_OUT)
NetBQ3_1: BQ3.1 DD7.12(PH0/OSC_IN/EVENTOUT)
NetBQ3_3: BQ3.3 DD7.13(PH1/OSC_OUT/EVENTOUT)
NetC59_1: C59.1 C61.1 C64.1 C65.1 DD7.21(VREF+) DD7.22(VDDA) L8.1
NetC60_1: C60.1 DD7.73(VCAP_2)
NetC63_1: C63.1 DD7.49(VCAP_1)
NetR30_2: R30.2 VD3.1 X5.1
NetR31_2: R31.2 VD4.1(CH1_IN)
NetR32_2: R32.2 VD4.3(CH2_IN)
NetR33_2: R33.2 VD5.1(CH1_IN)
NetR34_2: R34.2 VD5.3(CH2_IN)

Not connected (* = marked no-connect by the designer): BQ3 2; DD7 1(PE2/TRACECLK/FSMC_A23/ETH_MII_TXD3/EVENTOUT) 2(PE3/TRACED0/FSMC_A19/EVENTOUT_) 3(PE4/TRACED1/FSMC_A20/DCMI_D4/EVENTOUT) 4(PE5/TRACED2/FSMC_A21/TIM9_CH1/DCMI_D6/EVENTOUT) 5(PE6/TRACED3/FSMC_A22/TIM9_CH2/DCMI_D7/EVENTOUT) 7(PC13/RTC_OUT/RTC_TAMP1/RTC_TS/EVENTOUT) 8(PC14/OSC32_IN/EVENTOUT) 9(PC15/OSC32_OUT/EVENTOUT) 15(PC0/ADC123_IN10/OTG_HS_ULPI_STP/EVENTOUT) 16(PC1/ADC123_IN11/ETH_MDC/EVENTOUT) 17(PC2/ADC123_IN12/SPI2_MISO/OTG_HS_ULPI_DIR/ETH_MII_TXD2/I2S2EXT_SD/EVENTOUT) 18(PC3/ADC123_IN13/SPI2_MOSI/I2S2_SD/OTG_HS_ULPI_NXT/ETH_MII_TX_CLK/EVENTOUT) 23(PA0/ADC123_IN0/WKUP/USART2_CTS/UART4_TX/ETH_MII_CRS/TIM2_CH1_ETR/TIM5_CH1/TIM8_ETR/EVENTOUT) 24(PA1/ADC123_IN1/USART2_RTS/UART4_RX/ETH_RMII_REF_CLK/ETH_MII_RX_CLK/TIM5_CH2/TIM2_CH2/EVENTOUT) 25(PA2/ADC123_IN2/USART2_TX/TIM5_CH3/TIM9_CH1/TIM2_CH3/ETH_MDIO/_EVENTOUT_) 26(PA3/ADC123_IN3/USART2_RX/TIM5_CH4/TIM9_CH2/TIM2_CH4/OTG_HS_ULPI_D0/ETH_MII_COL/EVENTOUT) 29(PA4/ADC12_IN4/DAC_OUT1/SPI1_NSS/SPI3_NSS/USART2_CK/DCMI_HSYNC/OTG_HS_SOF/I2S3_WS/EVENTOUT) 30(PA5/ADC12_IN5/DAC_OUT2/SPI1_SCK/OTG_HS_ULPI_CK/TIM2_CH1_ETR/TIM8_CH1N/EVENTOUT) 31(PA6/ADC12_IN6/SPI1_MISO/TIM8_BKIN/TIM13_CH1/DCMI_PIXCLK/TIM3_CH1/TIM1_BKIN/EVENTOUT) 32(PA7/ADC12_IN7/SPI1_MOSI/TIM8_CH1N/TIM14_CH1/TIM3_CH2/ETH_MII_RX_DV/TIM1_CH1N/ETH_RMII_CRS_DV/EVENTOUT) 33(PC4/ADC12_IN14/ETH_RMII_RX_D0/ETH_MII_RX_D0/EVENTOUT) 34(PC5/ADC12_IN15/ETH_RMII_RX_D1/ETH_MII_RX_D1/EVENTOUT) 35(PB0/ADC12_IN8/TIM3_CH3/TIM8_CH2N/OTG_HS_ULPI_D1/ETH_MII_RXD2/TIM1_CH2N/EVENTOUT) 36(PB1/ADC12_IN9/TIM3_CH4/TIM8_CH3N/OTG_HS_ULPI_D2/ETH_MII_RXD3/TIM1_CH3N/EVENTOUT) 37(PB2/BOOT1/EVENTOUT) 38(PE7/FSMC_D4/TIM1_ETR/EVENTOUT) 39(PE8/FSMC_D5/_TIM1_CH1N/EVENTOUT) 40(PE9/FSMC_D6/TIM1_CH1/EVENTOUT) 41(PE10/FSMC_D7/TIM1_CH2N/EVENTOUT) 42(PE11/FSMC_D8/TIM1_CH2/EVENTOUT) 43(PE12/FSMC_D9/TIM1_CH3N/EVENTOUT) 44(PE13/FSMC_D10/TIM1_CH3/EVENTOUT) 45(PE14/FSMC_D11/TIM1_CH4/EVENTOUT) 46(PE15/FSMC_D12/TIM1_BKIN/EVENTOUT) 47(PB10/SPI2_SCK/I2S2_CK/I2C2_SCL/USART3_TX/OTG_HS_ULPI_D3/ETH_MII_RX_ER/TIM2_CH3/EVENTOUT) 48(PB11/I2C2_SDA/USART3_RX/OTG_HS_ULPI_D4/ETH_RMII_TX_EN/ETH_MII_TX_EN/TIM2_CH4/EVENTOUT) 55(PD8/FSMC_D13/USART3_TX/EVENTOUT) 56(PD9/FSMC_D14/USART3_RX/EVENTOUT) 57(PD10/FSMC_D15/USART3_CK/EVENTOUT) 58(PD11/FSMC_CLE/FSMC_A16/USART3_CTS/EVENTOUT) 59(PD12/FSMC_ALE/FSMC_A17/TIM4_CH1/USART3_RTS/EVENTOUT) 60(PD13/FSMC_A18/TIM4_CH2/EVENTOUT) 61(PD14/FSMC_D0/TIM4_CH3/EVENTOUT) 62(PD15/FSMC_D1/TIM4_CH4/EVENTOUT) 63(PC6/I2S2_MCK/TIM8_CH1/SDIO_D6/USART6_TX/DCMI_D0/TIM3_CH1/EVENTOUT) 64(PC7/I2S3_MCK/TIM8_CH2/SDIO_D7/USART6_RX/DCMI_D1/TIM3_CH2/EVENTOUT) 65(PC8/TIM8_CH3/SDIO_D0/USART6_CK/DCMI_D2/TIM3_CH3/EVENTOUT_) 66(PC9/I2S_CKIN/MCO2/TIM8_CH4/SDIO_D1/I2C3_SDA/DCMI_D3/TIM3_CH4/EVENTOUT) 67(PA8/MCO1/USART1_CK/TIM1_CH1/I2C3_SCL/OTG_FS_SOF/EVENTOUT) 68(PA9/USART1_TX/TIM1_CH2/I2C3_SMBA/DCMI_D0/OTG_FS_VBUS/EVENTOUT) 69(PA10/USART1_RX/_TIM1_CH3/DCMI_D1/OTG_FS_ID/EVENTOUT) 70(PA11/USART1_CTS/CAN1_RX/TIM1_CH4/OTG_FS_DM/EVENTOUT) 71(PA12/USART1_RTS/CAN1_TX/TIM1_ETR/OTG_FS_DP/EVENTOUT) 77(PA15/JTDI/SPI3_NSS/I2S3_WS/TIM2_CH1_ETR/SPI1_NSS/EVENTOUT) 78(PC10/SPI3_SCK/I2S3_CK/UART4_TX/SDIO_D2/DCMI_D8/USART3_TX/EVENTOUT_) 79(PC11/UART4_RX/SPI3_MISO/SDIO_D3/DCMI_D4/USART3_RX/I2S3EXT_SD/EVENTOUT) 80(PC12/UART5_TX/SDIO_CK/DCMI_D9/SPI3_MOSI/I2S3_SD/USART3_CK/EVENTOUT) 81(PD0/FSMC_D2/CAN1_RX/EVENTOUT) 82(PD1/FSMC_D3/CAN1_TX/EVENTOUT) 83(PD2/TIM3_ETR/UART5_RX/SDIO_CMD/DCMI_D11/EVENTOUT) 84(PD3/FSMC_CLK/USART2_CTS/EVENTOUT) 85(PD4/FSMC_NOE/USART2_RTS/EVENTOUT) 86(PD5/FSMC_NWE/USART2_TX/EVENTOUT) 87(PD6/FSMC_NWAIT/USART2_RX/EVENTOUT) 88(PD7/USART2_CK/FSMC_NE1/FSMC_NCE2/EVENTOUT) 90(PB4/~{JTRST}/SPI3_MISO/TIM3_CH1/SPI1_MISO/I2S3EXT_SD/EVENTOUT) 91(PB5/I2C1_SMBA/CAN2_RX/OTG_HS_ULPI_D7/ETH_PPS_OUT/TIM3_CH2/SPI1_MOSI/SPI3_MOSI/DCMI_D10/I2S3_SD/EVENTOUT) 92(PB6/I2C1_SCL/TIM4_CH1/CAN2_TX/DCMI_D5/USART1_TX/EVENTOUT) 93(PB7/I2C1_SDA/FSMC_NL/DCMI_VSYNC/USART1_RX/TIM4_CH2/EVENTOUT) 95(PB8/TIM4_CH3/SDIO_D4/TIM10_CH1/DCMI_D6/ETH_MII_TXD3/I2C1_SCL/CAN1_RX/EVENTOUT) 96(PB9/SPI2_NSS/I2S2_WS/TIM4_CH4/TIM11_CH1/SDIO_D5/DCMI_D7/I2C1_SDA/CAN1_TX/EVENTOUT) 97(PE0/TIM4_ETR/FSMC_NBL0/DCMI_D2/EVENTOUT) 98(PE1/FSMC_NBL1/DCMI_D3/EVENTOUT)

### Notes on the sheet
- Labels drawn without touching a wire or pin: GND
- Подп. и дата
- Инв. № дубл.
- Взам. инв. №
- Инв. № подл.
- Лист
- Изм.
- № докум.
- Подп.
- Дата
- Копировал
- Формат
- А1
- (in symbol dd0001, part A) MCU
- (in symbol dd0001, part B) MCU
- (in symbol vd0016) *DR
- (in symbol x0031) Цепь

### Library data of the parts
BQ3 = bq0002: =Описание; ID: bq0002; Фамилия: Самарин; Описание: Керамический резонатор 12 МГц со встроенными конденсаторами; Производитель: Murata Manufacturing Co., Ltd.; Корпус: 3,20 x 1,30 x 0,70; Наименование: CSTCE12M0G52A-R0; Частота: 12 МГц; HelpURL: https://www.murata.com/products/productdetail?partno=CSTCE12M0G52A-R0
C50 = c0134: =Описание; ID: c0134; Фамилия: Чернов; Описание: Конденсатор керамический чип 0603 4,7 мкФ 10 В ±10 %; Наименование: CC0603KRX5R6BB475; Производитель: YAGEO Corp.; Отклонение: ±10 %; Рабочие температуры: от –55 °С до +85 °С; Температурный коэффициент емкости: X5R; Корпус: 0603; Номинал: 4,7 мк; Номинальное напряжение: 10 В; HelpURL: https://www.yageo.com/upload/media/product/productsearch/datasheet/mlcc/UPY-GPHC_X5R_4V-to-50V_26.pdf
C51-C58 = c0080: =Описание; ID: c0080; Фамилия: Паньков; Описание: Конденсатор керамический чип 0402 100 нФ 10 В ±10 %; Наименование: CC0402KRX5R6BB104; Производитель: YAGEO Corp.; Отклонение: ±10 %; Рабочие температуры: от –55 °С до +85 °С; Температурный коэффициент емкости: X5R; Корпус: 0402; Номинал: 0,1 мк; Номинальное напряжение: 10 В; HelpURL: https://www.yageo.com/upload/media/product/productsearch/datasheet/mlcc/UPY-GPHC_X5R_4V-to-50V_26.pdf
C59 C64 = c0115: =Описание; ID: c0115; Фамилия: Паньков; Описание: Конденсатор керамический чип 0603 1 мкФ 16 В ±10 %; Наименование: CC0603KRX7R7BB105; Производитель: YAGEO Corp.; Отклонение: ±10 %; Рабочие температуры: от –55 °С до +125 °С; Температурный коэффициент емкости: X7R; Корпус: 0603; Номинал: 1 мк; Номинальное напряжение: 16 В; HelpURL: https://www.yageo.com/upload/media/product/productsearch/datasheet/mlcc/UPY-GPHC_X7R_6.3V-to-50V_20.pdf
C60 C63 = c0097: =Описание; ID: c0097; Фамилия: Чернов; Описание: Конденсатор керамический чип 0603 2,2 мкФ 10 В ±10 %; Наименование: CC0603KRX7R6BB225; Производитель: YAGEO Corp.; Отклонение: ±10 %; Рабочие температуры: от –55 °С до +125 °С; Температурный коэффициент емкости: X7R; Корпус: 0603; Номинал: 2,2 мк; Номинальное напряжение: 10 В; HelpURL: https://www.yageo.com/upload/media/product/productsearch/datasheet/mlcc/UPY-GPHC_X7R_6.3V-to-50V_20.pdf
C61 C65 = c0033: =Описание; ID: c0033; Фамилия: Паньков; Описание: Конденсатор керамический чип 0603 10 нФ 10 В ±10 %; Наименование: CC0603KRX7R6BB103; Производитель: YAGEO Corp.; Отклонение: ±10 %; Рабочие температуры: от –55 °С до +125 °С; Температурный коэффициент емкости: X7R; Корпус: 0603; Номинал: 0,01 мк; Номинальное напряжение: 10 В; HelpURL: https://www.yageo.com/upload/media/product/productsearch/datasheet/mlcc/UPY-GPHC_X7R_6.3V-to-50V_20.pdf
C62 = c0057: =Описание; ID: c0057; Фамилия: Паньков; Описание: Конденсатор керамический чип 0603 100 нФ 10 В ±10 %; Наименование: CC0603KRX7R6BB104; Производитель: YAGEO Corp.; Отклонение: ±10 %; Рабочие температуры: от –55 °С до +125 °С; Температурный коэффициент емкости: X7R; Корпус: 0603; Номинал: 0,1 мк; Номинальное напряжение: 10 В; HelpURL: https://www.yageo.com/upload/media/product/productsearch/datasheet/mlcc/UPY-GPHC_X7R_6.3V-to-50V_20.pdf
DD7 = dd0001: =Описание; ID: dd0001; Фамилия: Паньков; Описание: ARM Cortex-M4 32-разрядный микроконтроллер 168 МГц 1 Мбайт FLASH-памяти; Производитель: STMicroelectronics; Рабочее напряжение: от 1,8 В до 3,6 В; Максимальная тактовая частота: 168 МГц; Поддерживаемые интерфейсы: CAN, I2C, SDIO, I2S/SPI, UART/USART, USB; Рабочие температуры: от –40 °С до +85 °С; Корпус: LQFP-100; Наименование: STM32F407VGT6; HelpURL: https://www.st.com/en/microcontrollers-microprocessors/stm32f407vg.html
L8 = l0001: =Описание; ID: l0001; Фамилия: Ларионов; Описание: Ферритовая бусина 220 Ом ±25 %; Производитель: Murata Manufacturing Co., Ltd.; Сопротивление, 100 МГц: 220 Ом; Отклонение, 100 МГц: ±25 %; Сопротивление при постоянном токе: 0,05 Ом; Рабочие температуры: от –55 °С до +125 °С; Корпус: 0603; Наименование: BLM18KG221SH1D; HelpURL: https://www.murata.com/en-global/products/productdetail?partno=BLM18KG221SH1%23
R30 R35 = r0105: =Описание; ID: r0105; Фамилия: Самарин; Описание: Резистор чип 0603 10 кОм ±1 % 0,1 Вт; Наименование: RC0603FR-0710KL; Производитель: YAGEO Corp.; Отклонение: ±1 %; Номинальное напряжение: 75 В; Номинальный ток: 1 А; Рабочие температуры: от –55 °С до +155 °С; Корпус: 0603; Примечание: Ряд E24; Номинал: 10 к; HelpURL: https://www.yageo.com/upload/media/product/productsearch/datasheet/rchip/PYu-RC_Group_51_RoHS_L_11.pdf
R31-R34 = r0034: =Описание; ID: r0034; Фамилия: Ларионов; Описание: Резистор чип 0603 22 Ом ±1 % 0,1 Вт; Наименование: RC0603FR-0722RL; Производитель: YAGEO Corp.; Отклонение: ±1 %; Номинальное напряжение: 75 В; Номинальный ток: 1 А; Рабочие температуры: от –55 °С до +155 °С; Корпус: 0603; Примечание: Ряд E24; Номинал: 22; HelpURL: https://www.yageo.com/upload/media/product/productsearch/datasheet/rchip/PYu-RC_Group_51_RoHS_L_11.pdf
S1 = s0001: =Описание; ID: s0001; Фамилия: Паньков; Описание: Тактовая кнопка поверхностного монтажа; Производитель: TE Connectivity; Ток нагрузки: 50 мА @ 24 В; Сопротивление контакта: 100 мОм; Количество контактов: 4; Рабочие температуры: от –35 °С до +85 °С; Промывка: Запрещена; Корпус: 6,00 x 6,00 x 4,98; Наименование: FSM4JSMA; HelpURL: https://www.te.com/usa-en/product-4-1437565-1.html
VD3 = vd0002: =Описание; ID: vd0002; Фамилия: Паньков; Описание: Диод Шоттки 40 В 1 А; Производитель: ON Semiconductor; Максимальное прямое напряжение: 0,88 В; Максимальное обратное напряжение: 40 В; Максимальный прямой ток: 1 А; Рабочие температуры: от –55 °С до +125 °С; Корпус: SOD-123FL; Наименование: MBR140SFT1G; HelpURL: https://www.onsemi.com/products/discretes-drivers/diodes-rectifiers/schottky-diodes-schottky-rectifiers/mbr140sf
VD4 VD5 = vd0016: =Описание; ID: vd0016; Фамилия: Паньков; Описание: Диодная сборка для подавления помех 5 В; Производитель: Texas Instruments Inc.; Корпус: SOT-23-6; Наименование: TPD2S017DBVR; HelpURL: https://www.ti.com/product/TPD2S017
X5 = x0031: =Описание; Contact_1: VDD; Contact_2: SWCLK; Contact_3: GND; Contact_4: SWDIO; Contact_5: nRST; Contact_6: SWO; ID: x0031; Фамилия: Самарин; Описание: PLD 6 pin 2,54 мм вилка прямой; Производитель: Connfly Electronic Co., Ltd.; Наименование: DS1021-2x3SF11-B; HelpURL: http://en.connfly.group/product/xVkr=EusQssAN0gN=Aos=mU+UrVkR9kqEAN0gN9g+WqANB+A

## Nets that join several sheets
+3.3V: project_vodorezov_switch1 (27 pins), project_vodorezov_switch2 (26 pins), project_vodorezov_switch3 (21 pins)
CLK50_1: project_vodorezov_switch1 (DD2.4), project_vodorezov_switch2 (BQ2.1 C40.1 DD5.4 DD6.4)
GND: project_vodorezov_switch1 (96 pins), project_vodorezov_switch2 (24 pins), project_vodorezov_switch3 (27 pins)
MCU_MAC_SPI_SCK: project_vodorezov_switch1 (DD1.P5), project_vodorezov_switch3 (DD7.52)
MCU_MAC_SPI_SDI: project_vodorezov_switch1 (DD1.N5), project_vodorezov_switch3 (DD7.54)
MCU_MAC_SPI_SDO: project_vodorezov_switch1 (DD1.P4), project_vodorezov_switch3 (DD7.53)
MCU_MAC_SPI_SS_N: project_vodorezov_switch1 (DD1.N6), project_vodorezov_switch3 (DD7.51)
MCU_nRST: project_vodorezov_switch1 (DD2.15), project_vodorezov_switch2 (DD5.15 DD6.15), project_vodorezov_switch3 (5 pins)
MII1_CRS_DV: project_vodorezov_switch1 (DD1.A4), project_vodorezov_switch2 (DD5.11)
MII1_RXD0: project_vodorezov_switch1 (DD1.A6), project_vodorezov_switch2 (DD5.8)
MII1_RXD1: project_vodorezov_switch1 (DD1.B5), project_vodorezov_switch2 (DD5.7)
MII1_RXER: project_vodorezov_switch1 (DD1.B3), project_vodorezov_switch2 (DD5.10)
MII1_TXD0: project_vodorezov_switch1 (DD1.B9), project_vodorezov_switch2 (DD5.17)
MII1_TXD1: project_vodorezov_switch1 (DD1.A9), project_vodorezov_switch2 (DD5.18)
MII1_TXEN: project_vodorezov_switch1 (DD1.B7), project_vodorezov_switch2 (DD5.16)
MII2_CRS_DV: project_vodorezov_switch1 (DD1.A11), project_vodorezov_switch2 (DD6.11)
MII2_RXD0: project_vodorezov_switch1 (DD1.A13), project_vodorezov_switch2 (DD6.8)
MII2_RXD1: project_vodorezov_switch1 (DD1.B12), project_vodorezov_switch2 (DD6.7)
MII2_RXER: project_vodorezov_switch1 (DD1.B10), project_vodorezov_switch2 (DD6.10)
MII2_TXD0: project_vodorezov_switch1 (DD1.E13), project_vodorezov_switch2 (DD6.17)
MII2_TXD1: project_vodorezov_switch1 (DD1.E14), project_vodorezov_switch2 (DD6.18)
MII2_TXEN: project_vodorezov_switch1 (DD1.C13), project_vodorezov_switch2 (DD6.16)